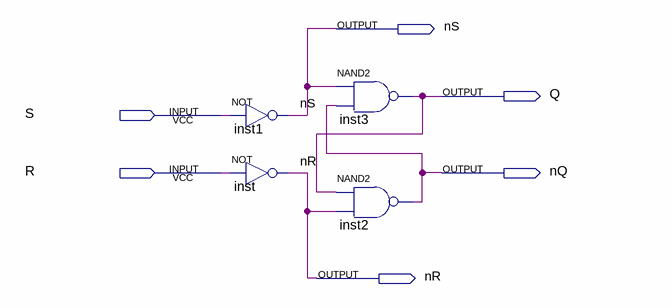
[diagram p0: schematic sheet]
// Quartus schematic qua.bdf as structural Verilog: 4 symbols, 6 pins
module qua (
  input  S,
  input  R,
  output nS,
  output Q,
  output nQ,
  output nR
);

  not inst1 (nS, S);
  not inst (nR, R);
  nand inst3 (Q, nS, nQ);
  nand inst2 (nQ, Q, nR);
endmodule
